# Altium schematic sheet PowerBooster.SchDoc
size A; SheetNumber: 5; SheetTotal: 5
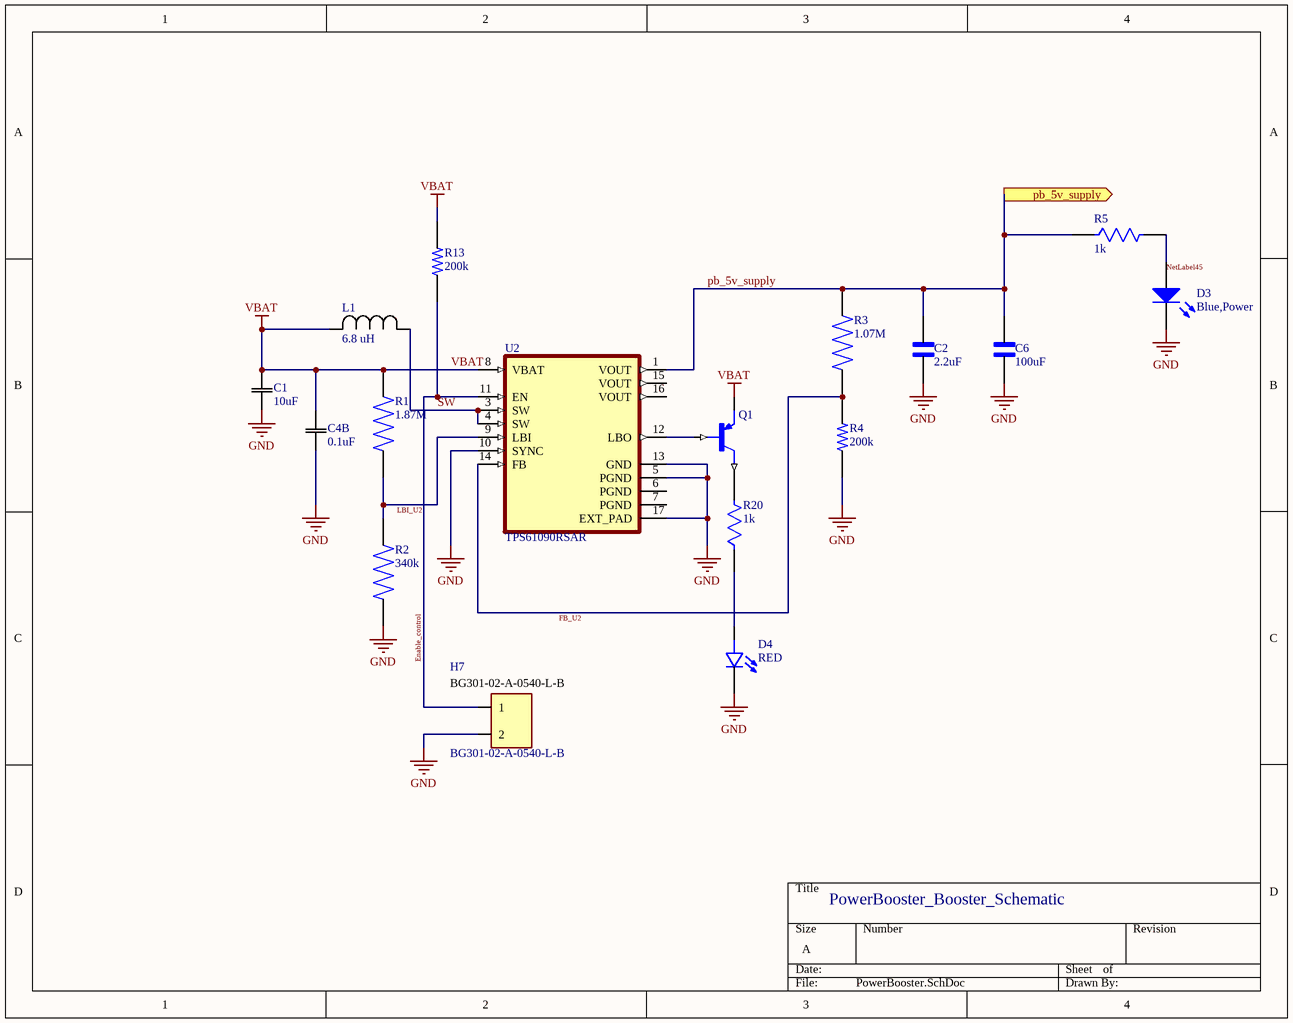
[diagram p0: PowerBooster.SchDoc]

## Parts
C1  10uF  [C10uF]
C2  2.2uF  [C2.2UF]
C4  0.1uF  [Res 0805 1k]  (part B of 2)
C6  100uF  [C100uF]
D3  Blue,Power  [LED_blue_0805]
D4  RED  [LED RED]
H7  BG301-02-A-0540-L-B  [BG301-02-A-0540-L-B]
L1  6.8 uH  [L6.8uH]
Q1  MMUN2133LT1G  [PNP BJT]  (value not drawn)
R1  1.87M  [Res 0805 1k]
R2  340k  [R340K]
R3  1.07M  [R1.07M]
R4  200k  [Res 0805 1k]
R5  1k  [Res 0805 1k]
R13  200k  [Res 0805 1k]
R20  1k  [Res 0805 1k]
U2  TPS61090RSAR  [Boost Converter]

## Ports
pb_5v_supply (out)

## Nets
GND: C1.1 C2.1 C4.1 C6.1 D3.1(K) D4.C H7.2 R2.1 R4.1 U2.5(PGND) U2.10(SYNC) U2.13(GND) U2.17(EXT_PAD)
VBAT: C1.2 C4.2 L1.2 Q1.2(E) R1.2 R13.2 U2.8(VBAT)
Enable_control: H7.1 R13.1 U2.11(EN)
FB_U2: R3.1 R4.2 U2.14(FB)
LBI_U2: R1.1 R2.2 U2.9(LBI)
NetLabel45: D3.2(A) R5.2
pb_5v_supply: C2.2 C6.2 R3.2 R5.1 U2.1(VOUT) ; port pb_5v_supply
SW: L1.1 U2.3(SW) U2.4(SW)
NetD4_A: D4.A R20.1
NetQ1_1: Q1.1(B) U2.12(LBO)
NetQ1_3: Q1.3(C) R20.2

Not connected (* = marked no-connect by the designer): U2 6(PGND) 7(PGND) 15(VOUT) 16(VOUT)

## Notes on the sheet
- PowerBooster_Booster_Schematic

## Library data of the parts
C1 = CL21A106KOQNNNE: Ceramic capacitor SMD-0805 10000nF (10uF) /16V X5R# K +-10% Samsung , RoHS/4000pcs/; Tolerance: 10%; Voltage Rating: 16V; Dielectric: X7R; Supplier 1: Digi-Key; Supplier Part Number 1: 1276-1096-1-ND; Manufacturer: Samsung; Manufacturer Part Number: CL21A106KOQNNNE; RoHS: Yes; Category: Ceramic Capacitors; Stock 1: 250843; Pricing 1: 1=0.11000, 10=0.08100, 50=0.04400, 100=0.03600, 500=0.02568, 1000=0.02018 (USD); Mount: Surface Mount; Case/Package: 0805; Case Code (Metric): 2012; Case Code (Imperial): 0805; Min Operating Temperature: -55°C; Max Operating Temperature: 85°C; Package Quantity: 1; Packaging: Tape and Reel; Capacitance: 10uF; Voltage Rating (DC): 16V; Voltage: 16V; Series: CL; Construction: Flat; Length: 2mm; Width: 0.049inch; Height: 1.25mm; Thickness: 0.055inch; Depth: 1.25mm; Radiation Hardening: No; Lead Free: Lead Free; RoHS Compliant: Yes; ComponentLink1URL: https://datasheet.ciiva.com/25798/cl21a106koqnnne-25798133.pdf?src-supplier=Digi-Key; ComponentLink1Description: https://datasheet.ciiva.com/25798/cl21a106koqnnne-25798133.pdf?src-supplier=Digi-Key; ComponentLink2URL: https://datasheet.ciiva.com/15216/getdatasheetpartid-358435-15216234.pdf?src-supplier=Verical; ComponentLink2Description: https://datasheet.ciiva.com/15216/getdatasheetpartid-358435-15216234.pdf?src-supplier=Verical; ComponentLink3URL: https://datasheet.ciiva.com/16740/cl05b104kq5nnnc-16740697.pdf?src-supplier=Future+Electronics; ComponentLink3Description: https://datasheet.ciiva.com/16740/cl05b104kq5nnnc-16740697.pdf?src-supplier=Future+Electronics
C2 = JMK105BJ225KV-F: CAP CER 2.2UF 6.3V X5R 0402; Manufacturer: Taiyo Yuden; Tolerance: 10%; Supplier 1: Digi-Key; Supplier Part Number 1: 587-5867-1-ND; Manufacturer Part Number: JMK105BJ225KV-F; RoHS: Yes; Category: Ceramic Capacitors; Stock 1: 1524772; Pricing 1: 1=0.10000, 10=0.05900, 50=0.03240, 100=0.02650, 500=0.01892, 1000=0.01486, 2500=0.01351, 5000=0.01243 (USD); Mount: Surface Mount; Case/Package: 0402; Case Code (Imperial): 0402; Case Code (Metric): 1005; Min Operating Temperature: -55°C; Max Operating Temperature: 85°C; Packaging: Tape and Reel; Capacitance: 2.2uF; Package Quantity: 10000; Voltage Rating: 6.3V; Voltage Rating (DC): 6.3V; Dielectric: X5R; Termination: SMD/SMT; Resistor Type: Ceramic; Series: M; Construction: Flat; Length: 1mm; Width: 0.5mm; Height: 0.5mm; Thickness: 0.022inch; Depth: 0.5mm; Radiation Hardening: No; RoHS Compliant: Yes; ComponentLink1URL: https://datasheet.ciiva.com/15921/tmk105b7103kv-15921011.pdf?src-supplier=Onlinecomponents.com; ComponentLink1Description: https://datasheet.ciiva.com/15921/tmk105b7103kv-15921011.pdf?src-supplier=Onlinecomponents.com; ComponentLink2URL: https://datasheet.ciiva.com/30178/cmultilayerceramiccapacitor-30178599.pdf?src-supplier=Onlinecomponents.com; ComponentLink2Description: https://datasheet.ciiva.com/30178/cmultilayerceramiccapacitor-30178599.pdf?src-supplier=Onlinecomponents.com
C4 = C0805C104M5UACTU: Cap Ceramic 0.1uF 50V Z5U 20% SMD 0805 85C Paper T/R; Manufacturer: KEMET; Capacitance: 100nF; Dissipation Factor: 4%; Supplier 1: Digi-Key; Manufacturer Part Number: C0805C104M5UACTU; RoHS: Yes; Category: Ceramic Capacitors; Stock 1: 106; Pricing 1: 1=0.18000, 10=0.12700, 50=0.07220, 100=0.05980, 500=0.04194, 1000=0.03472 (USD); Mount: Surface Mount,PCB; Case/Package: 0805; Number of Pins: 2; Case Code (Imperial): 0805; Case Code (Metric): 2012; Dielectric Material: Ceramic; Contact Plating: Tin,Matte; Min Operating Temperature: 10°C; Max Operating Temperature: 85°C; Tolerance: 20%; Voltage Rating: 50V; Packaging: Tape and Reel; Package Quantity: 1; Voltage Rating (DC): 50V; Dielectric: Z5U; Termination: SMD/SMT; Series: C; Voltage: 50V; Construction: Flat; Length: 2mm; Width: 1.2mm; Height: 0.78mm; Depth: 1.25mm; Thickness: 0.035inch; Lead Pitch: 0.75mm; Radiation Hardening: No; RoHS Compliant: Yes; REACH SVHC: No SVHC; Lead Free: Lead Free; ComponentLink1URL: https://datasheet.ciiva.com/18193/getdatasheetpartid-89715-18193450.pdf?src-supplier=Verical; ComponentLink1Description: https://datasheet.ciiva.com/18193/getdatasheetpartid-89715-18193450.pdf?src-supplier=Verical; ComponentLink2URL: https://datasheet.ciiva.com/26847/getdatasheetpartid-314452-26847798.pdf?src-supplier=Verical; ComponentLink2Description: https://datasheet.ciiva.com/26847/getdatasheetpartid-314452-26847798.pdf?src-supplier=Verical; ComponentLink3URL: https://datasheet.ciiva.com/7842/kem-c1004-z5u-smd-7842541.pdf?src-supplier=Element14; ComponentLink3Description: https://datasheet.ciiva.com/7842/kem-c1004-z5u-smd-7842541.pdf?src-supplier=Element14; Supplier Part Number 1: 399-C0805C104M5UAC7800CT-ND
C6 = EEE-HA0J101WR: Cap Aluminum 100uF 6.3V 20% (5 X 5.4mm) SMD 47mA 1000 hr 105°C T/R; Manufacturer: Panasonic; Polarity: Polar; Life (Hours): 1000Hour; Leakage Current: 6.3uA; Lead Diameter: 0.65mm; Supplier 1: Digi-Key; Supplier Part Number 1: PCE4156CT-ND; Manufacturer Part Number: EEE-HA0J101WR; RoHS: Yes; Category: Aluminum Electrolytic Capacitors; Stock 1: 728; Pricing 1: 1=0.44000, 10=0.30400, 50=0.21260, 100=0.18220, 500=0.13668 (USD); Mount: Surface Mount,PCB; Case/Package: Radial; Contact Plating: Tin; Min Operating Temperature: -40°C; Max Operating Temperature: 105°C; Tolerance: 20%; Ripple Current: 47mA; Capacitance: 100uF; Packaging: Tape and Reel; Voltage Rating: 6.3V; Ripple Current (AC): 47mA; Package Quantity: 1000; Voltage Rating (DC): 6.3V; Termination: SMD/SMT; Voltage: 6.3V; Series: HA; Construction: Cylindrical; Diameter: 5mm; Length: 5.5mm; Width: 650um; Height: 5.4mm; Lead Pitch: 1.5mm; Height - Seated (Max): 0.213inch; Radiation Hardening: No; REACH SVHC: Unknown; Lead Free: Lead Free; RoHS Compliant: Yes; ComponentLink1URL: https://datasheet.ciiva.com/2985/aba0000ce3-2985609.pdf?src-supplier=Avnet; ComponentLink1Description: https://datasheet.ciiva.com/2985/aba0000ce3-2985609.pdf?src-supplier=Avnet; ComponentLink2URL: https://datasheet.ciiva.com/24068/aba0000ce3-259063-24068875.pdf?src-supplier=Mouser; ComponentLink2Description: https://datasheet.ciiva.com/24068/aba0000ce3-259063-24068875.pdf?src-supplier=Mouser; ComponentLink3URL: https://datasheet.ciiva.com/11675/aba0000ce3-11675884.pdf?src-supplier=Avnet; ComponentLink3Description: https://datasheet.ciiva.com/11675/aba0000ce3-11675884.pdf?src-supplier=Avnet; ComponentLink4URL: https://datasheet.ciiva.com/28694/1446029-28694662.pdf?src-supplier=Element14; ComponentLink4Description: https://datasheet.ciiva.com/28694/1446029-28694662.pdf?src-supplier=Element14; ComponentLink5URL: https://datasheet.ciiva.com/43459/1446029-43459799.pdf?src-supplier=Farnell; ComponentLink5Description: https://datasheet.ciiva.com/43459/1446029-43459799.pdf?src-supplier=Farnell; ComponentLink6URL: https://datasheet.ciiva.com/6134/1446029-6134153.pdf?src-supplier=Farnell; ComponentLink6Description: https://datasheet.ciiva.com/6134/1446029-6134153.pdf?src-supplier=Farnell; ComponentLink7URL: https://datasheet.ciiva.com/16433/aba0000ce3-16433449.pdf?src-supplier=Future+Electronics; ComponentLink7Description: https://datasheet.ciiva.com/16433/aba0000ce3-16433449.pdf?src-supplier=Future+Electronics; ComponentLink8URL: https://datasheet.ciiva.com/30215/33aba0000ce3-30215722.pdf?src-supplier=Onlinecomponents.com; ComponentLink8Description: https://datasheet.ciiva.com/30215/33aba0000ce3-30215722.pdf?src-supplier=Onlinecomponents.com; ComponentLink9URL: https://datasheet.ciiva.com/17536/aba0000ce3-17536407.pdf?src-supplier=Avnet+Europe; ComponentLink9Description: https://datasheet.ciiva.com/17536/aba0000ce3-17536407.pdf?src-supplier=Avnet+Europe; ComponentLink10URL: https://datasheet.ciiva.com/46390/1446029-46390441.pdf?src-supplier=Element14; ComponentLink10Description: https://datasheet.ciiva.com/46390/1446029-46390441.pdf?src-supplier=Element14
D3 = 150080BS75000: Led, Blue, 470 Nm, 3.2 V, 30 Ma, 145 Mcd Rohs Compliant: Yes; Manufacturer: Wurth Electronics; Luminous Intensity: 145mcd; Viewing Angle: 140°; Forward Voltage: 3.2V; Lens Style: Clear,Rectangular; Forward Current: 30mA; Dominant Wavelength: 470nm; Test Current: 20mA; Supplier 1: Digi-Key; Manufacturer Part Number: 150080BS75000; RoHS: Yes; Category: LEDs; Stock 1: 55201; Pricing 1: 1=0.18000, 50=0.17100, 100=0.14700, 500=0.12700 (USD); Mount: Surface Mount; Case/Package: 0805; Color: Blue; Case Code (Metric): 2012; Case Code (Imperial): 0805; Min Operating Temperature: -40°C; Max Operating Temperature: 85°C; Packaging: Tape and Reel; Wavelength: 470nm; Package Quantity: 4000; Length: 2mm; Width: 1.25mm; Height: 0.7mm; RoHS Compliant: Yes; REACH SVHC: Unknown; Lead Free: Lead Free; ComponentLink1URL: https://datasheet.ciiva.com/22656/1740214-22656954.pdf?src-supplier=Element14; ComponentLink1Description: https://datasheet.ciiva.com/22656/1740214-22656954.pdf?src-supplier=Element14; ComponentLink2URL: https://datasheet.ciiva.com/23843/150080bs75000-23843251.pdf?src-supplier=Newark; ComponentLink2Description: https://datasheet.ciiva.com/23843/150080bs75000-23843251.pdf?src-supplier=Newark; ComponentLink3URL: https://datasheet.ciiva.com/29279/759433-da-01-en-chipled-0805-w-kl-blau-150080bs75000-29279203.pdf?src-supplier=Conrad; ComponentLink3Description: https://datasheet.ciiva.com/29279/759433-da-01-en-chipled-0805-w-kl-blau-150080bs75000-29279203.pdf?src-supplier=Conrad; ComponentLink4URL: https://datasheet.ciiva.com/29562/150080bs75000-29562922.pdf?src-supplier=Digi-Key; ComponentLink4Description: https://datasheet.ciiva.com/29562/150080bs75000-29562922.pdf?src-supplier=Digi-Key; ComponentLink5URL: https://datasheet.ciiva.com/29562/150080bs75000-29562923.pdf?src-supplier=Digi-Key; ComponentLink5Description: https://datasheet.ciiva.com/29562/150080bs75000-29562923.pdf?src-supplier=Digi-Key; Supplier Part Number 1: 732-4982-1-ND
D4 = SML-D12U1WT86: Red 620nm LED Indication - Discrete 2.2V 0603 (1608 Metric); Manufacturer: Rohm; Lens Color: White; Lens Transparency: Diffused; Luminous Intensity: 63mcd; Test Current: 20mA; Supplier 1: Digi-Key; Supplier Part Number 1: SML-D12U1WT86CT-ND; Manufacturer Part Number: SML-D12U1WT86; RoHS: Yes; Category: LEDs; Stock 1: 1414; Pricing 1: 1=0.21000, 10=0.11500, 100=0.05340, 500=0.04928, 1000=0.03861 (USD); Mount: Surface Mount; Case/Package: 0603; Color: Red; Case Code (Metric): 1608; Case Code (Imperial): 0603; Packaging: Tape and Reel; Dominant Wavelength: 620nm; Forward Voltage: 2.2V; Length: 1.6mm; Width: 0.8mm; Height: 0.65mm; Lead Free: Lead Free; RoHS Compliant: Yes; ComponentLink1URL: https://www.rohm.com/datasheet/SML-D12U1W?src-supplier=Digi-Key; ComponentLink1Description: https://www.rohm.com/datasheet/SML-D12U1W?src-supplier=Digi-Key
L1 = B82464G4682M000: Inductor Power Shielded Wirewound 6.8uH 20% 100KHz Ferrite 4.3A 0.02Ohm DCR Automotive T/R; Manufacturer: TDK EPCOS; Self Resonant Frequency: 28MHz; Current Rating: 2A; Saturation Current: 4.6A; DC Resistance (DCR): 20mR; Supplier 1: Digi-Key; Supplier Part Number 1: 495-1808-1-ND; Manufacturer Part Number: B82464G4682M000; RoHS: Yes; Category: Fixed Inductors; Stock 1: 47; Pricing 1: 1=2.11000, 10=1.94900, 25=1.78640, 50=1.52640, 100=1.36410, 250=1.16920 (USD); Mount: Surface Mount; Case/Package: Nonstandard; Core Material: Ferrite; Weight: 0.070548oz; Min Operating Temperature: -55°C; Max Operating Temperature: 150°C; Inductance Tolerance: 20%; Packaging: Tape and Reel; Shielding: Shielded; Tolerance: 20%; Package Quantity: 750; Inductance: 6.8uH; Max DC Current: 4.3A; Termination: SMD/SMT; Resistor Type: Wirewound; Test Frequency: 100kHz; DC Current: 4.3A; RMS Current (Irms): 4.3A; Length: 10.4mm; Width: 10.4mm; Height: 4.8mm; Height - Seated (Max): 0.189inch; Depth: 10.4mm; Ratings: AEC-Q200; Radiation Hardening: No; REACH SVHC: No SVHC; Military Standard: Not; Lead Free: Lead Free; RoHS Compliant: Yes; ComponentLink1URL: https://datasheet.ciiva.com/11803/0900766b804ee4ce-11803039.pdf?src-supplier=RSComponents; ComponentLink1Description: https://datasheet.ciiva.com/11803/0900766b804ee4ce-11803039.pdf?src-supplier=RSComponents; ComponentLink2URL: https://datasheet.ciiva.com/29368/001092599-da-01-en-smt-induktivitaet-b82464g4682m000-750-st-29368829.pdf?src-supplier=Conrad; ComponentLink2Description: https://datasheet.ciiva.com/29368/001092599-da-01-en-smt-induktivitaet-b82464g4682m000-750-st-29368829.pdf?src-supplier=Conrad; ComponentLink3URL: https://datasheet.ciiva.com/22623/1899158-22623110.pdf?src-supplier=Element14; ComponentLink3Description: https://datasheet.ciiva.com/22623/1899158-22623110.pdf?src-supplier=Element14
Q1 = MMUN2133LT1G: PNP Ic=-100mA Vceo=-50V hfe=80~140 P=246mW; Manufacturer: ON Semiconductor; Collector Emitter Voltage (VCEO): 50V; Max Power Dissipation: 246mW; Max Collector Current: 100mA; Element Configuration: Single; hFE Min: 80; Collector Emitter Saturation Voltage: 250mV; Voltage Rating (DC): -50V; Current Rating: -100mA; Supplier 1: Digi-Key; Supplier Part Number 1: MMUN2133LT1GOSCT-ND; Manufacturer Part Number: MMUN2133LT1G; RoHS: Yes; Category: BJTs; Stock 1: 8590; Pricing 1: 1=0.15000, 10=0.13600, 100=0.07430, 500=0.04570, 1000=0.03116 (USD); Case/Package: SOT-23-3; Number of Pins: 3; Contact Plating: Tin,Matte; Min Operating Temperature: -55°C; Max Operating Temperature: 150°C; Package Quantity: 1; Packaging: Tape and Reel; Collector Emitter Breakdown Voltage: 50V; Max Output Current: 100mA; Operating Supply Voltage: 50V; Polarity: PNP; Continuous Collector Current: 100mA; Power Dissipation: 246mW; Max Breakdown Voltage: 50V; Series: -; Collector-emitter Voltage-Max: 250mV; Length: 3.04mm; Width: 1.4mm; Height: 1.01mm; Radiation Hardening: No; Lead Free: Lead Free; RoHS Compliant: Yes; REACH SVHC: No SVHC; Halogen Free: Halogen Free; ComponentLink1URL: https://datasheet.ciiva.com/30480/0900766b8124e2ed-30480364.pdf?src-supplier=RSComponents; ComponentLink1Description: https://datasheet.ciiva.com/30480/0900766b8124e2ed-30480364.pdf?src-supplier=RSComponents; ComponentLink2URL: https://datasheet.ciiva.com/23819/1708306-23819938.pdf?src-supplier=Newark; ComponentLink2Description: https://datasheet.ciiva.com/23819/1708306-23819938.pdf?src-supplier=Newark; ComponentLink3URL: https://datasheet.ciiva.com/15139/getdatasheetpartid-53178-15139583.pdf?src-supplier=Verical; ComponentLink3Description: https://datasheet.ciiva.com/15139/getdatasheetpartid-53178-15139583.pdf?src-supplier=Verical; ComponentLink4URL: https://datasheet.ciiva.com/990/dta143z-d-990631.pdf?src-supplier=Digi-Key; ComponentLink4Description: https://datasheet.ciiva.com/990/dta143z-d-990631.pdf?src-supplier=Digi-Key; ComponentLink5URL: https://datasheet.ciiva.com/990/dta143z-d-990632.pdf?src-supplier=Digi-Key; ComponentLink5Description: https://datasheet.ciiva.com/990/dta143z-d-990632.pdf?src-supplier=Digi-Key; ComponentLink6URL: https://datasheet.ciiva.com/990/dta143z-d-990633.pdf?src-supplier=Digi-Key; ComponentLink6Description: https://datasheet.ciiva.com/990/dta143z-d-990633.pdf?src-supplier=Digi-Key; ComponentLink7URL: https://datasheet.ciiva.com/11209/dta114e-d-11209209.pdf?src-supplier=Avnet; ComponentLink7Description: https://datasheet.ciiva.com/11209/dta114e-d-11209209.pdf?src-supplier=Avnet; ComponentLink8URL: https://datasheet.ciiva.com/16353/dta143z-d-16353804.pdf?src-supplier=Future+Electronics; ComponentLink8Description: https://datasheet.ciiva.com/16353/dta143z-d-16353804.pdf?src-supplier=Future+Electronics; ComponentLink9URL: https://datasheet.ciiva.com/22661/1708306-22661189.pdf?src-supplier=Element14; ComponentLink9Description: https://datasheet.ciiva.com/22661/1708306-22661189.pdf?src-supplier=Element14; ComponentLink10URL: https://datasheet.ciiva.com/25999/dta114e-d-25999642.pdf?src-supplier=Avnet+Europe; ComponentLink10Description: https://datasheet.ciiva.com/25999/dta114e-d-25999642.pdf?src-supplier=Avnet+Europe
R1 = MCR10ERTF1874: Res SMD 1.87M Ohm 1% 1/8W 0805; Manufacturer: Rohm; Resistance: 1.87MR; Max Power Dissipation: 125mW; Temperature Coefficient: 100ppm/°C; Voltage Rating (DC): 150V; Supplier 1: Digi-Key; Manufacturer Part Number: MCR10ERTF1874; RoHS: Yes; Category: Chip SMD Resistors; Stock 1: 2848; Pricing 1: 1=0.10000, 10=0.01500, 100=0.00620, 1000=0.00278, 2500=0.00242 (USD); Case/Package: 0805; Case Code (Metric): 2012; Case Code (Imperial): 0805; Min Operating Temperature: -55°C; Max Operating Temperature: 155°C; Packaging: Tape and Reel; Tolerance: 1%; Number of Terminations: 2; Resistor Type: Thick Film; Package Quantity: 5000; Length: 0.079inch; Width: 0.049inch; Height: 0.024inch; RoHS Compliant: Yes; ComponentLink1URL: https://datasheet.ciiva.com/18605/mcr-g-18605815.pdf?src-supplier=Digi-Key; ComponentLink1Description: https://datasheet.ciiva.com/18605/mcr-g-18605815.pdf?src-supplier=Digi-Key; ComponentLink2URL: https://datasheet.ciiva.com/18605/mcr-g-18605816.pdf?src-supplier=Digi-Key; ComponentLink2Description: https://datasheet.ciiva.com/18605/mcr-g-18605816.pdf?src-supplier=Digi-Key; ComponentLink3URL: https://datasheet.ciiva.com/18605/mcr-g-18605817.pdf?src-supplier=Digi-Key; ComponentLink3Description: https://datasheet.ciiva.com/18605/mcr-g-18605817.pdf?src-supplier=Digi-Key; Supplier Part Number 1: RHM1.87MCHCT-ND
R2 = RMCF0805FT340K: Res Thick Film 0805 340K Ohm 1% 1/8W ±100ppm/°C Molded SMD SMD Paper T/R; Manufacturer: Stackpole Electronics; Resistance: 340kR; Max Power Dissipation: 125mW; Supplier 1: Digi-Key; Supplier Part Number 1: RMCF0805FT340KCT-ND; Manufacturer Part Number: RMCF0805FT340K; RoHS: Yes; Category: Chip SMD Resistors; Stock 1: 3256; Pricing 1: 1=0.10000, 10=0.02700, 100=0.01090, 1000=0.00488, 2500=0.00423 (USD); Mount: Surface Mount; Case/Package: 0805; Case Code (Metric): 2012; Case Code (Imperial): 0805; Contact Plating: Tin,Matte; Min Operating Temperature: -55°C; Max Operating Temperature: 155°C; Tolerance: 1%; Packaging: Tape and Reel; Resistor Type: Thick Film; Number of Terminations: 2; Temperature Coefficient: 100ppm/°C; Features: Automotive AEC-Q200; Series: RMCF; Length: 0.079inch; Width: 0.049inch; Height: 0.026inch; Radiation Hardening: No; RoHS Compliant: Yes; ComponentLink1URL: http://components.arrow.com/part/dataview/47688621S8206446N1174?src-supplier=Arrow+Electronics; ComponentLink1Description: http://components.arrow.com/part/dataview/47688621S8206446N1174?src-supplier=Arrow+Electronics; ComponentLink2URL: https://www.seielect.com/catalog/SEI-RMCF_RMCP.pdf?src-supplier=Avnet; ComponentLink2Description: https://www.seielect.com/catalog/SEI-RMCF_RMCP.pdf?src-supplier=Avnet; ComponentLink3URL: https://www.seielect.com/Catalog/SEI-RMCF_RMCP.pdf?src-supplier=Digi-Key; ComponentLink3Description: https://www.seielect.com/Catalog/SEI-RMCF_RMCP.pdf?src-supplier=Digi-Key
R3 = RMCF0603FT1M07: Res Thick Film 0603 1.07M Ohm 1% 1/10W ±200ppm/°C Molded SMD SMD Paper T/R; Manufacturer: Stackpole Electronics; Resistance: 1.07MR; Supplier 1: Digi-Key; Supplier Part Number 1: RMCF0603FT1M07CT-ND; Manufacturer Part Number: RMCF0603FT1M07; RoHS: Yes; Category: Chip SMD Resistors; Stock 1: 21406; Pricing 1: 1=0.10000, 10=0.02500, 100=0.01020, 1000=0.00457, 2500=0.00397 (USD); Mount: Surface Mount; Case/Package: 0603; Contact Plating: Tin,Matte; Min Operating Temperature: -55°C; Max Operating Temperature: 155°C; Packaging: Tape and Reel; Tolerance: 1%; Resistor Type: Thick Film; Temperature Coefficient: 200ppm/°C; Radiation Hardening: No; RoHS Compliant: Yes; ComponentLink1URL: https://www.seielect.com/catalog/sei-rmcf_rmcp.pdf?src-supplier=Digi-Key; ComponentLink1Description: https://www.seielect.com/catalog/sei-rmcf_rmcp.pdf?src-supplier=Digi-Key; ComponentLink2URL: https://www.seielect.com/catalog/SEI-RMCF_RMCP.pdf?src-supplier=Avnet; ComponentLink2Description: https://www.seielect.com/catalog/SEI-RMCF_RMCP.pdf?src-supplier=Avnet
R4 R13 = ERJ-6GEYJ204V: Res Thick Film 0805 200K Ohm 5% 1/8W ±200ppm/°C Molded SMD Punched Carrier T/R; Manufacturer: Panasonic; Resistance: 200kR; Max Power Dissipation: 125mW; Voltage Rating: 150V; Supplier 1: Digi-Key; Manufacturer Part Number: ERJ-6GEYJ204V; RoHS: Yes; Category: Chip SMD Resistors; Stock 1: 61840; Pricing 1: 1=0.10000, 10=0.06900, 100=0.02800, 1000=0.01259, 2500=0.01092 (USD); Mount: Surface Mount; Case/Package: 0805; Case Code (Imperial): 0805; Case Code (Metric): 2012; Contact Plating: Tin; Min Operating Temperature: -55°C; Max Operating Temperature: 155°C; Packaging: Tape and Reel; Tolerance: 5%; Resistor Type: Thick Film; Number of Terminations: 2; Temperature Coefficient: 200ppm/°C; Features: Automotive AEC-Q200; Series: ERJ; Construction: Rectangular; Power Rating: 125mW; Package Quantity: 1; Termination: SMD/SMT; Voltage Rating (DC): 150V; Technology: THICK FILM; Resistance Tolerance: 5%; Length: 2mm; Width: 1.25mm; Height: 0.6mm; Depth: 1.25mm; Radiation Hardening: No; Military Standard: Not; RoHS Compliant: Yes; Lead Free: Lead Free; REACH SVHC: No SVHC; ComponentLink1URL: https://datasheet.ciiva.com/11821/0900766b80f806dd-11821568.pdf?src-supplier=RSComponents; ComponentLink1Description: https://datasheet.ciiva.com/11821/0900766b80f806dd-11821568.pdf?src-supplier=RSComponents; ComponentLink2URL: https://datasheet.ciiva.com/5868/1500035-5868198.pdf?src-supplier=Farnell; ComponentLink2Description: https://datasheet.ciiva.com/5868/1500035-5868198.pdf?src-supplier=Farnell; ComponentLink3URL: https://datasheet.ciiva.com/9184/aoa0000ce1-9184617.pdf?src-supplier=Avnet; ComponentLink3Description: https://datasheet.ciiva.com/9184/aoa0000ce1-9184617.pdf?src-supplier=Avnet; ComponentLink4URL: https://datasheet.ciiva.com/30055/4aoa0000ce1-30055656.pdf?src-supplier=Onlinecomponents.com; ComponentLink4Description: https://datasheet.ciiva.com/30055/4aoa0000ce1-30055656.pdf?src-supplier=Onlinecomponents.com; ComponentLink5URL: https://datasheet.ciiva.com/16762/70255313-16762071.pdf?src-supplier=Allied+Electronics; ComponentLink5Description: https://datasheet.ciiva.com/16762/70255313-16762071.pdf?src-supplier=Allied+Electronics; ComponentLink6URL: https://datasheet.ciiva.com/28675/1678796-28675838.pdf?src-supplier=Element14; ComponentLink6Description: https://datasheet.ciiva.com/28675/1678796-28675838.pdf?src-supplier=Element14; ComponentLink7URL: https://datasheet.ciiva.com/46374/1500035-46374298.pdf?src-supplier=Element14; ComponentLink7Description: https://datasheet.ciiva.com/46374/1500035-46374298.pdf?src-supplier=Element14; ComponentLink8URL: https://datasheet.ciiva.com/46387/1500035-46387371.pdf?src-supplier=Element14; ComponentLink8Description: https://datasheet.ciiva.com/46387/1500035-46387371.pdf?src-supplier=Element14; ComponentLink9URL: https://datasheet.ciiva.com/16513/aoa0000ce1-16513755.pdf?src-supplier=Avnet+Asia; ComponentLink9Description: https://datasheet.ciiva.com/16513/aoa0000ce1-16513755.pdf?src-supplier=Avnet+Asia; Supplier Part Number 1: P200KACT-ND
R5 R20 = CRGCQ0805F1K0: Res Thick Film 0805 1K Ohm 1% 0.125W(1/8W) ±100ppm/C Pad SMD Automotive T/R; Manufacturer: TE Connectivity; Resistance: 1kR; Max Power Dissipation: 125mW; Temperature Coefficient: 100ppm/°C; Supplier 1: Digi-Key; Manufacturer Part Number: CRGCQ0805F1K0; RoHS: Yes; Category: Chip SMD Resistors; Stock 1: 111660; Pricing 1: 1=0.10000, 10=0.05800, 100=0.02350, 1000=0.01057, 2500=0.00918 (USD); Case/Package: 0805; Case Code (Imperial): 0805; Case Code (Metric): 2012; Min Operating Temperature: -55°C; Max Operating Temperature: 155°C; Resistor Type: Thick Film; Packaging: Cut Tape; Tolerance: 1%; Number of Terminations: 2; Features: Moisture Resistant,Automotive AEC-Q200; RoHS Compliant: Yes; ComponentLink1URL: https://4donline.ihs.com/images/VipMasterIC/IC/TYEL/TYEL-S-A0004929575/TYEL-S-A0004929575-1.pdf?hkey=52A5661711E402568146F3353EA87419&src-supplier=Farnell; ComponentLink1Description: https://4donline.ihs.com/images/VipMasterIC/IC/TYEL/TYEL-S-A0004929575/TYEL-S-A0004929575-1.pdf?hkey=52A5661711E402568146F3353EA87419&src-supplier=Farnell; ComponentLink2URL: https://www.te.com/commerce/DocumentDelivery/DDEController?Action=srchrtrv&DocNm=1773204-3&DocType=DS&DocLang=English&src-supplier=Digi-Key; ComponentLink2Description: https://www.te.com/commerce/DocumentDelivery/DDEController?Action=srchrtrv&DocNm=1773204-3&DocType=DS&DocLang=English&src-supplier=Digi-Key; ComponentLink3URL: https://www.te.com/commerce/DocumentDelivery/DDEController?Action=srchrtrv&amp;DocNm=1773204-3&amp;DocType=DS&amp;DocLang=English&src-supplier=Digi-Key; ComponentLink3Description: https://www.te.com/commerce/DocumentDelivery/DDEController?Action=srchrtrv&amp;DocNm=1773204-3&amp;DocType=DS&amp;DocLang=English&src-supplier=Digi-Key; Supplier Part Number 1: A129749CT-ND
U2 = TPS61090RSAR: Conv DC-DC 1.8V to 5.5V Synchronous Step Up Single-Out 1.8V to 5.5V 0.5A 16-Pin VQFN EP T/R; Manufacturer: Texas Instruments; Output Current: 2A; Number of Outputs: 1; Max Output Current: 500mA; Efficiency: 96%; Switching Frequency: 600kHz; Synchronous Rectifier: Yes; Quiescent Current: 20uA; Topology: Boost; Output Type: Adjustable; Output Configuration: Positive; Supplier 1: Digi-Key; Supplier Part Number 1: 296-15259-6-ND; Manufacturer Part Number: TPS61090RSAR; RoHS: Yes; Category: Voltage Regulators - Switching; Pricing 1: 1=2.72000, 10=2.44700, 25=2.30800, 100=1.96650, 250=1.84652, 500=1.61570, 1000=1.52425 (USD); Mount: Surface Mount; Case/Package: QFN; Number of Pins: 16; Weight: 0.001464oz; Min Operating Temperature: -40°C; Max Operating Temperature: 85°C; Packaging: Tape and Reel; Output Voltage: 5.5V; Package Quantity: 1; Min Input Voltage: 1.8V; Max Input Voltage: 5.5V; Min Output Voltage: 1.8V; Max Output Voltage: 5.5V; Operating Supply Voltage: 5.5V; Length: 4mm; Width: 4mm; Height: 0.9mm; Radiation Hardening: No; Lead Free: Lead Free; RoHS Compliant: Yes; ComponentLink1URL: https://datasheet.ciiva.com/3221/tps61092-3221395.pdf?src-supplier=Avnet; ComponentLink1Description: https://datasheet.ciiva.com/3221/tps61092-3221395.pdf?src-supplier=Avnet; ComponentLink2URL: https://datasheet.ciiva.com/15113/getdatasheetpartid-188313-15113725.pdf?src-supplier=Verical; ComponentLink2Description: https://datasheet.ciiva.com/15113/getdatasheetpartid-188313-15113725.pdf?src-supplier=Verical; ComponentLink3URL: https://datasheet.ciiva.com/26901/tps61090rsar-26901797.pdf?src-supplier=IIIC; ComponentLink3Description: https://datasheet.ciiva.com/26901/tps61090rsar-26901797.pdf?src-supplier=IIIC; ComponentLink4URL: https://datasheet.ciiva.com/2025/tps61090-2025960.pdf?src-supplier=Digi-Key; ComponentLink4Description: https://datasheet.ciiva.com/2025/tps61090-2025960.pdf?src-supplier=Digi-Key; ComponentLink5URL: https://datasheet.ciiva.com/2025/tps61090-2025959.pdf?src-supplier=Digi-Key; ComponentLink5Description: https://datasheet.ciiva.com/2025/tps61090-2025959.pdf?src-supplier=Digi-Key; ComponentLink6URL: https://datasheet.ciiva.com/2025/tps61090-2025961.pdf?src-supplier=Digi-Key; ComponentLink6Description: https://datasheet.ciiva.com/2025/tps61090-2025961.pdf?src-supplier=Digi-Key